# EAGLE design kamstrup-wifi (EAGLE 7.2.0)
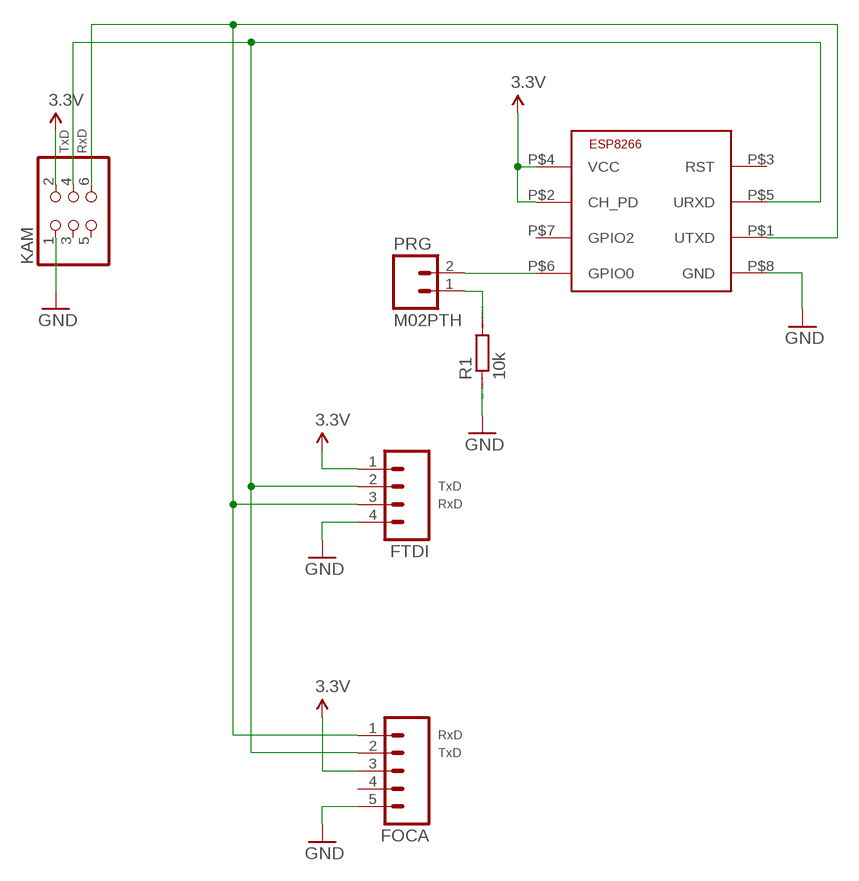
[diagram p0: schematic, sheet 1]

## Parts
FOCA  M05PTH  [1X05]
FTDI  M04PTH  [1X04]
KAM  PINHD-2X3  [2X03]
PRG  M02PTH  [1X02]
R1  10k  R-EU_M0805  [M0805]
U$1  ESP8266-01  [ESP-01]

## Nets
3.3V: FOCA.3 FTDI.1 KAM.2 U$1.P$2(CH_PD) U$1.P$4(VCC)
GND: FOCA.5 FTDI.4 KAM.1 R1.1 U$1.P$8(GND)
N$1: FOCA.1 FTDI.3 KAM.6 U$1.P$1(UTXD)
N$2: FOCA.2 FTDI.2 KAM.4 U$1.P$5(URXD)
N$3: PRG.2 U$1.P$6(GPIO0)
N$4: PRG.1 R1.2
Unconnected: FOCA.4 KAM.3 KAM.5 U$1.P$3(RST) U$1.P$7(GPIO2)

## Notes on the sheet
- TxD | RxD
- TxD
- RxD
- RxD
- TxD

## Library data of the parts
FOCA = SparkFun-Connectors:M05: Header 5 Standard 5-pin 0.1" header. Use with straight break away headers (SKU : PRT-00116), right angle break away headers (PRT-00553), swiss pins (PRT-00743), machine pins (PRT-00117), and female headers (PRT-00115). Molex polarized connector foot print use with SKU : PRT-08230 with associated crimp pins and housings.
FTDI = SparkFun-Connectors:M04: Header 4 Standard 4-pin 0.1" header. Use with straight break away headers (SKU : PRT-00116), right angle break away headers (PRT-00553), swiss pins (PRT-00743), machine pins (PRT-00117), and female headers (PRT-00115). Molex polarized connector foot print use with SKU : PRT-08231 with associated crimp pins and housings. 1MM SMD Version SKU: PRT-10208
KAM = SparkFun-Connectors:PINHD-2X3: PIN HEADER
PRG = SparkFun-Connectors:M02: Standard 2-pin 0.1" header. Use with - straight break away headers ( PRT-00116) - right angle break away headers (PRT-00553) - swiss pins (PRT-00743) - machine pins (PRT-00117) - female headers (PRT-00115) Molex polarized connector foot print use with: PRT-08233 with associated crimp pins and housings. 2.54_SCREWTERM for use with PRT-10571. 3.5mm Screw Terminal footprints for PRT-08084 5mm Screw Terminal footprints for use with PRT-08433
R1 = resistor:R-EU_: RESISTOR, European symbol; SPICEPREFIX: R
U$1 = ESP8266:ESP8266-01: ESP8266 - ESP-01 Module

## Board
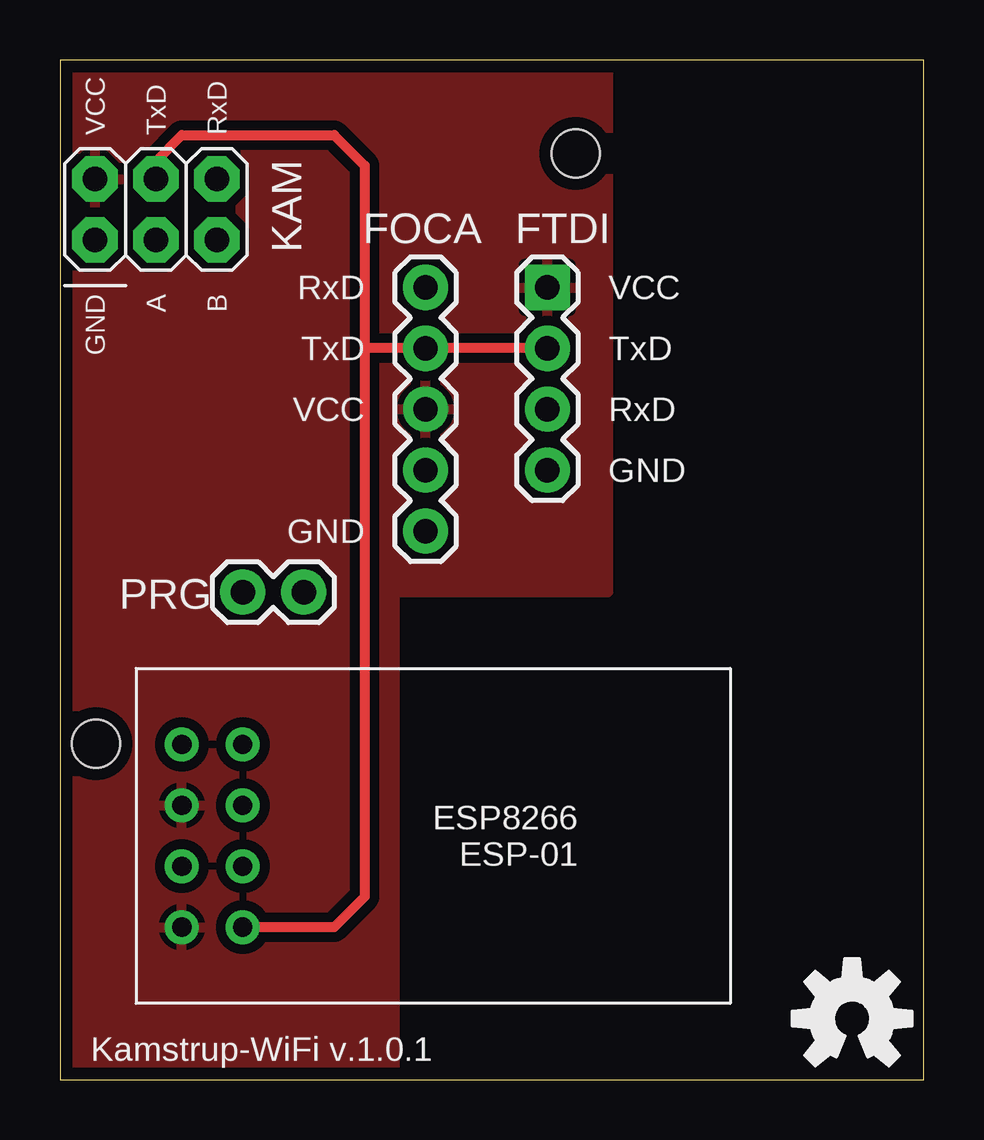
[diagram p1: board, top side]
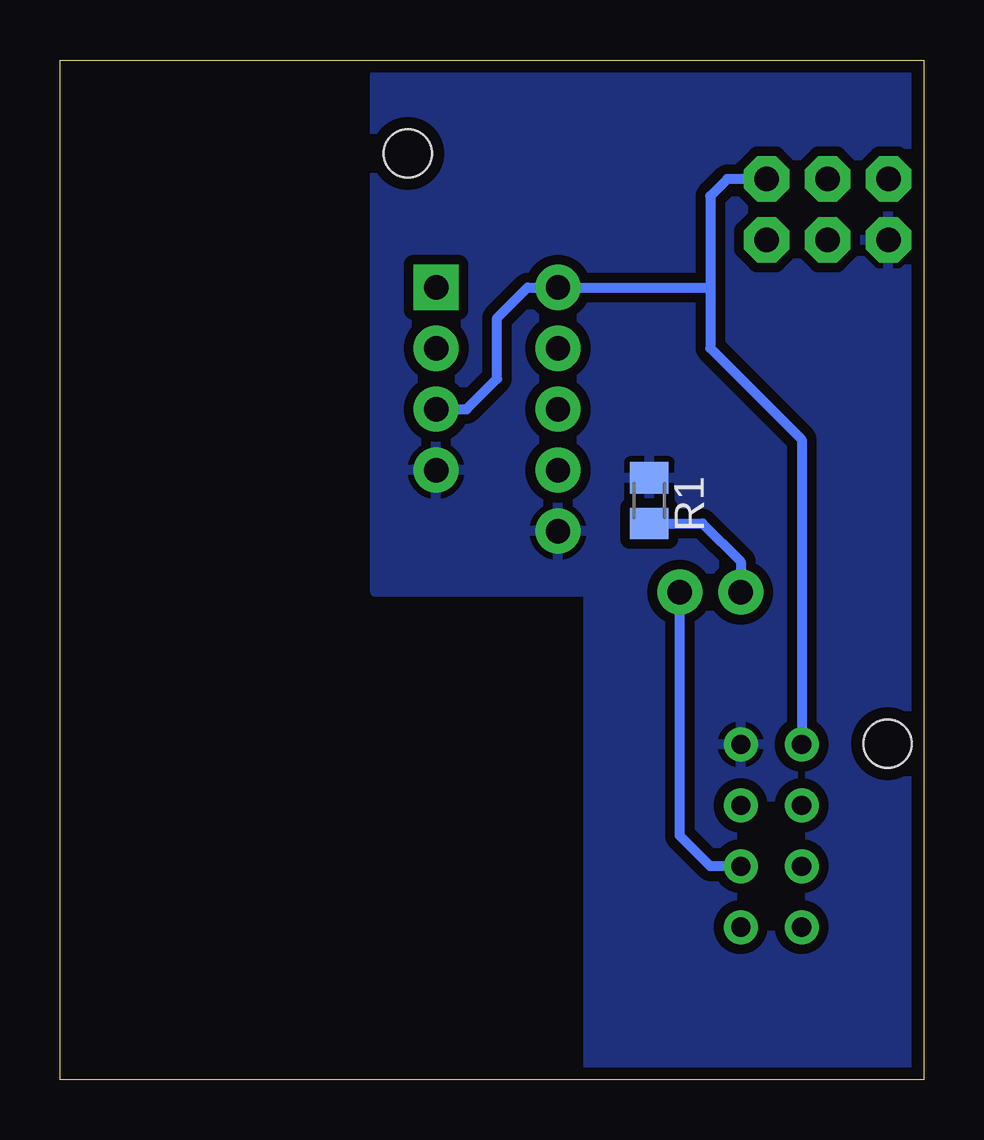
[diagram p2: board, bottom side, seen from below]

Size 36 x 42.5 mm. Coordinates in mm from the lower left corner, seen from the top.
Outline: 0,0 36,0 36,42.5 0,42.5 0,0
Copper layers (1*16): Top 0.035mm / dielectric 1.5mm / Bottom 0.035mm
Design rules "default *": minimum track width 10mil, minimum drill 24mil, track to track 8mil, track to pad 8mil, pad to pad 8mil, via to via 8mil, smd to smd 8mil, copper to edge 20mil, drill to drill 20mil, minimum pad ring 10mil, minimum via ring 8mil, stop-mask expansion 4mil, vias tented up to drill 0mil, thermal gap 10mil
Holes 2 mm at 1.5,14 21.5,38.6

### Footprints (pad centres in the part's own frame; a part is rotated, then mirrored left to right if it is on the bottom)
1X05 = drill 1.016 pad 1.88: 1 0,0; 2 2.54,0; 3 5.08,0; 4 7.62,0; 5 10.16,0
1X04 = drill 1.016 pad 1.88 square: 1 0,0 | drill 1.016 pad 1.88: 2 2.54,0; 3 5.08,0; 4 7.62,0
2X03 = drill 1.016 pad 1.88 octagon: 1 -2.54,-1.27; 2 -2.54,1.27; 3 0,-1.27; 4 0,1.27; 5 2.54,-1.27; 6 2.54,1.27
1X02 = drill 1.016 pad 1.88: 1 0,0; 2 2.54,0
M0805 = smd 1.3 x 1.6: 1 -0.95,0; 2 0.95,0
ESP-01 = drill 0.8 pad 1.422: P$1 0,0; P$2 2.54,0; P$3 5.08,0; P$4 7.62,0; P$5 7.62,2.54; P$6 5.08,2.54; P$7 2.54,2.54; P$8 0,2.54

### Placement (x,y rotation side)
FOCA  15.24,33.02 270 top
FTDI  20.32,33.02 270 top
KAM  4,36.27 0 top
PRG  7.62,20.32 0 top
R1  11.43,24.13 270 bottom
U$1  5.08,13.97 270 top
U$2  [OSHW-LOGO-M]  33.02,2.54 0 top

### Tracks (layer width: path | path; a pad name or v marks a point on that pad's centre or on a via)
3.3V
  pour Top (isolate 0.406): 0,0 13.97,0 13.97,20.32 22.86,20.32 22.86,41.91 0,41.91
GND
  pour Bottom (isolate 0.406): 0,0 13.97,0 13.97,20.32 22.86,20.32 22.86,41.91 0,41.91
N$1
  Bottom 0.406: FTDI.3 19.05,27.94 17.78,29.21 17.78,31.75 16.51,33.02 FOCA.1 8.89,33.02 | KAM.6 8.18,37.54 8.89,36.83 8.89,33.02 | 8.89,33.02 8.89,30.48 5.08,26.67 U$1.P$1
N$2
  Top 0.406: FTDI.2 FOCA.2 12.7,30.48 | KAM.4 4,38.29 5.08,39.37 11.43,39.37 12.7,38.1 12.7,30.48 | 12.7,30.48 12.7,7.62 11.43,6.35 U$1.P$5
N$3
  Bottom 0.406: U$1.P$6 8.89,8.89 10.16,10.16 PRG.2
N$4
  Bottom 0.406: R1.2 9.21,23.18 7.62,21.59 PRG.1

### Text on the board
tNames: VCC | TxD | RxD | GND | A | B | RxD | VCC | TxD | TxD | VCC | RxD | GND | GND | ESP8266 / ESP-01 | Kamstrup-WiFi v.1.0.1